# Altium schematic sheet Thermokoppel.SchDoc
size A4; SheetNumber: 1; SheetTotal: 4
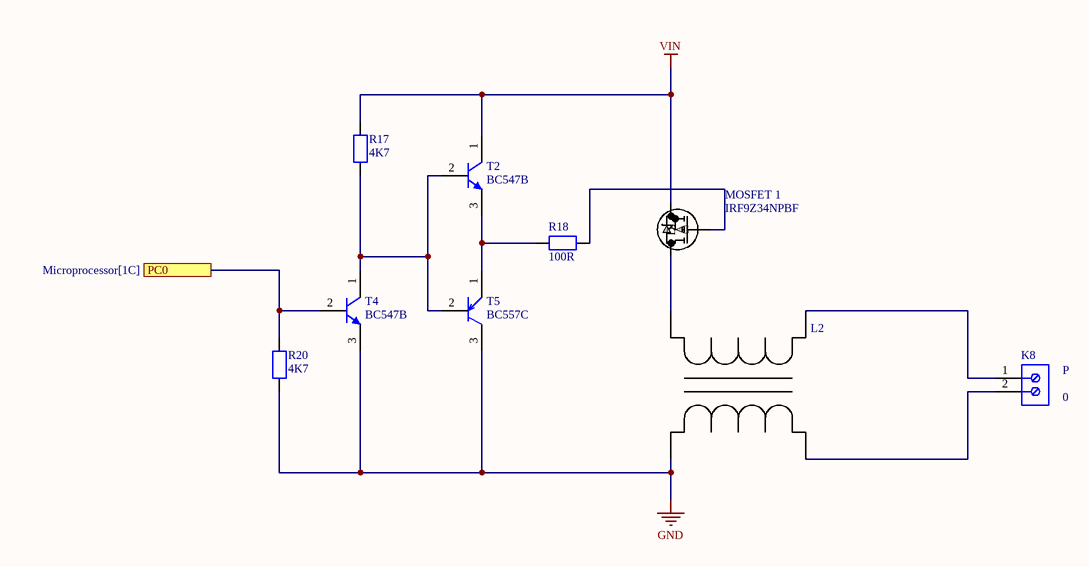
[diagram p0: Thermokoppel.SchDoc]

## Parts
K8  (no value)  [2pin connector]
L2  (no value)  [spoel2]
MOSFET_1  IRF9Z34NPBF  [IRF]
R17  4K7  [Weerstand 1M ohm]
R18  100R  [Weerstand 1M ohm]
R20  4K7  [Weerstand 1M ohm]
T2  BC547B  [sot23]
T4  BC547B  [sot23]
T5  BC557C  [BC557C]

## Ports
PC0 (see Microprocessor[1C])

## Nets
GND: L2.2 R20.1 T4.3(E) T5.3(E)
VIN: MOSFET_1.3(S) R17.2 T2.1(C)
PC0: R20.2 T4.2(B) ; port PC0
NetK8_1: K8.1 L2.3
NetK8_2: K8.2 L2.4
NetL2_1: L2.1 MOSFET_1.2(D)
NetMOSFET_1_1: MOSFET_1.1(G) R18.2
NetR17_1: R17.1 T2.2(B) T4.1(C) T5.2(B)
NetR18_1: R18.1 T2.3(E) T5.1(C)

## Notes on the sheet
- (near K8) P
- (near K8) 0

## Library data of the parts
K8 = Printkroonsteen 2pin: PC Terminal Block, Pitch 6.35 mm, 1 x 2 Position, Height 21.5 mm, Tail Lenght 5.1 mm, RoHS, Bulk; Manufacturer: Phoenix Contact; Package Description: PC Terminal Block, Pitch 6.35 mm, 1 x 2 Position, Height 21.5 mm, Tail Lenght 5.1 mm; Datasheet URL: http://media.digikey.com/pdf/Data%20Sheets/Phoenix%20Contact%20PDFs/1714955.pdf; Package Reference: 1714955; Manufacturer URL: http://www.phoenixcontact.com/; Datasheet Version: 02/2010; Mounting Technology: ThroughHole
L2 = Spoel2: No Description Available; Mfr_Name: Laird; Manufacturer_Part_Number: CM2545X171B-10; Type: DEV; Copyright: Copyright (C) 2023 Ultra Librarian. All rights reserved.; RefDes: RefDes
MOSFET_1 = IRF9Z34NPBF: No Description Available; Mfr_Name: Infineon; Copyright: Copyright (C) 2023 Ultra Librarian. All rights reserved.; Manufacturer_Part_Number: IRF9Z34NPBF; RefDes: RefDes; Type: DEV
R17 R20 = Weerstand 4K7 ohm: Manufacturer: Vishay Dale; Part Number: CRCW08054K70JNEB
R18 = Weerstand 100 ohm: Manufacturer: Vishay Dale; Part Number: CRCW0805100RFKEA
T2 T4 = sot23 (bc547): Amplifier Transistor, NPN Silicon, 3-Pin TO-92, Bulk Box; Manufacturer: On Semiconductor; IC Continuous (A): 0.1; fT Min (MHz): 150; DatasheetVersion: Rev. 7; ComponentLink1URL: http://www.onsemi.com/; Polarity: NPN; RoHS: FALSE; ComponentLink1Description: Manufacturer URL; Packing: Bulk Box; PackageDescription: 3-Pin Transistor Outline, Body 4.825 x 3.685 mm, Pitch 1.27 mm; ComponentLink3URL: http://www.onsemi.cn/pub_link/Collateral/2N6426-D.PDF; ComponentLink2Description: Datasheet; PackageVersion: Rev. AM; PackageReference: TO-92-3-29-11_AM_SL; ComponentLink3Description: Package Specification; Mounting Technology: Through Hole; PartNumber: BC547B; ComponentLink2URL: http://www.onsemi.com/pub_link/Collateral/BC546-D.PDF
T5 = BC557C: Amplifier Transistor, PNP Silicon, 3-Pin TO-92, Bulk Box; Manufacturer: On Semiconductor; IC Continuous (A): -0.1; Polarity: PNP; PartNumber: BC557C; PackageVersion: Rev. AM; RoHS: FALSE; PackageDescription: 3-Pin Transistor Outline, Body 4.825 x 3.685 mm, Pitch 1.27 mm; Packing: Bulk Box; ComponentLink2Description: Datasheet; DatasheetVersion: Rev. 3; ComponentLink3Description: Package Specification; Mounting Technology: Through Hole; ComponentLink2URL: http://www.onsemi.com/pub_link/Collateral/BC556B-D.PDF; ComponentLink1URL: http://www.onsemi.com/; ComponentLink1Description: Manufacturer URL; ComponentLink3URL: http://www.onsemi.cn/pub_link/Collateral/2N6426-D.PDF; PackageReference: TO-92-3-29-11_AM_SL